# EAGLE design MCU (EAGLE 7.1.0)
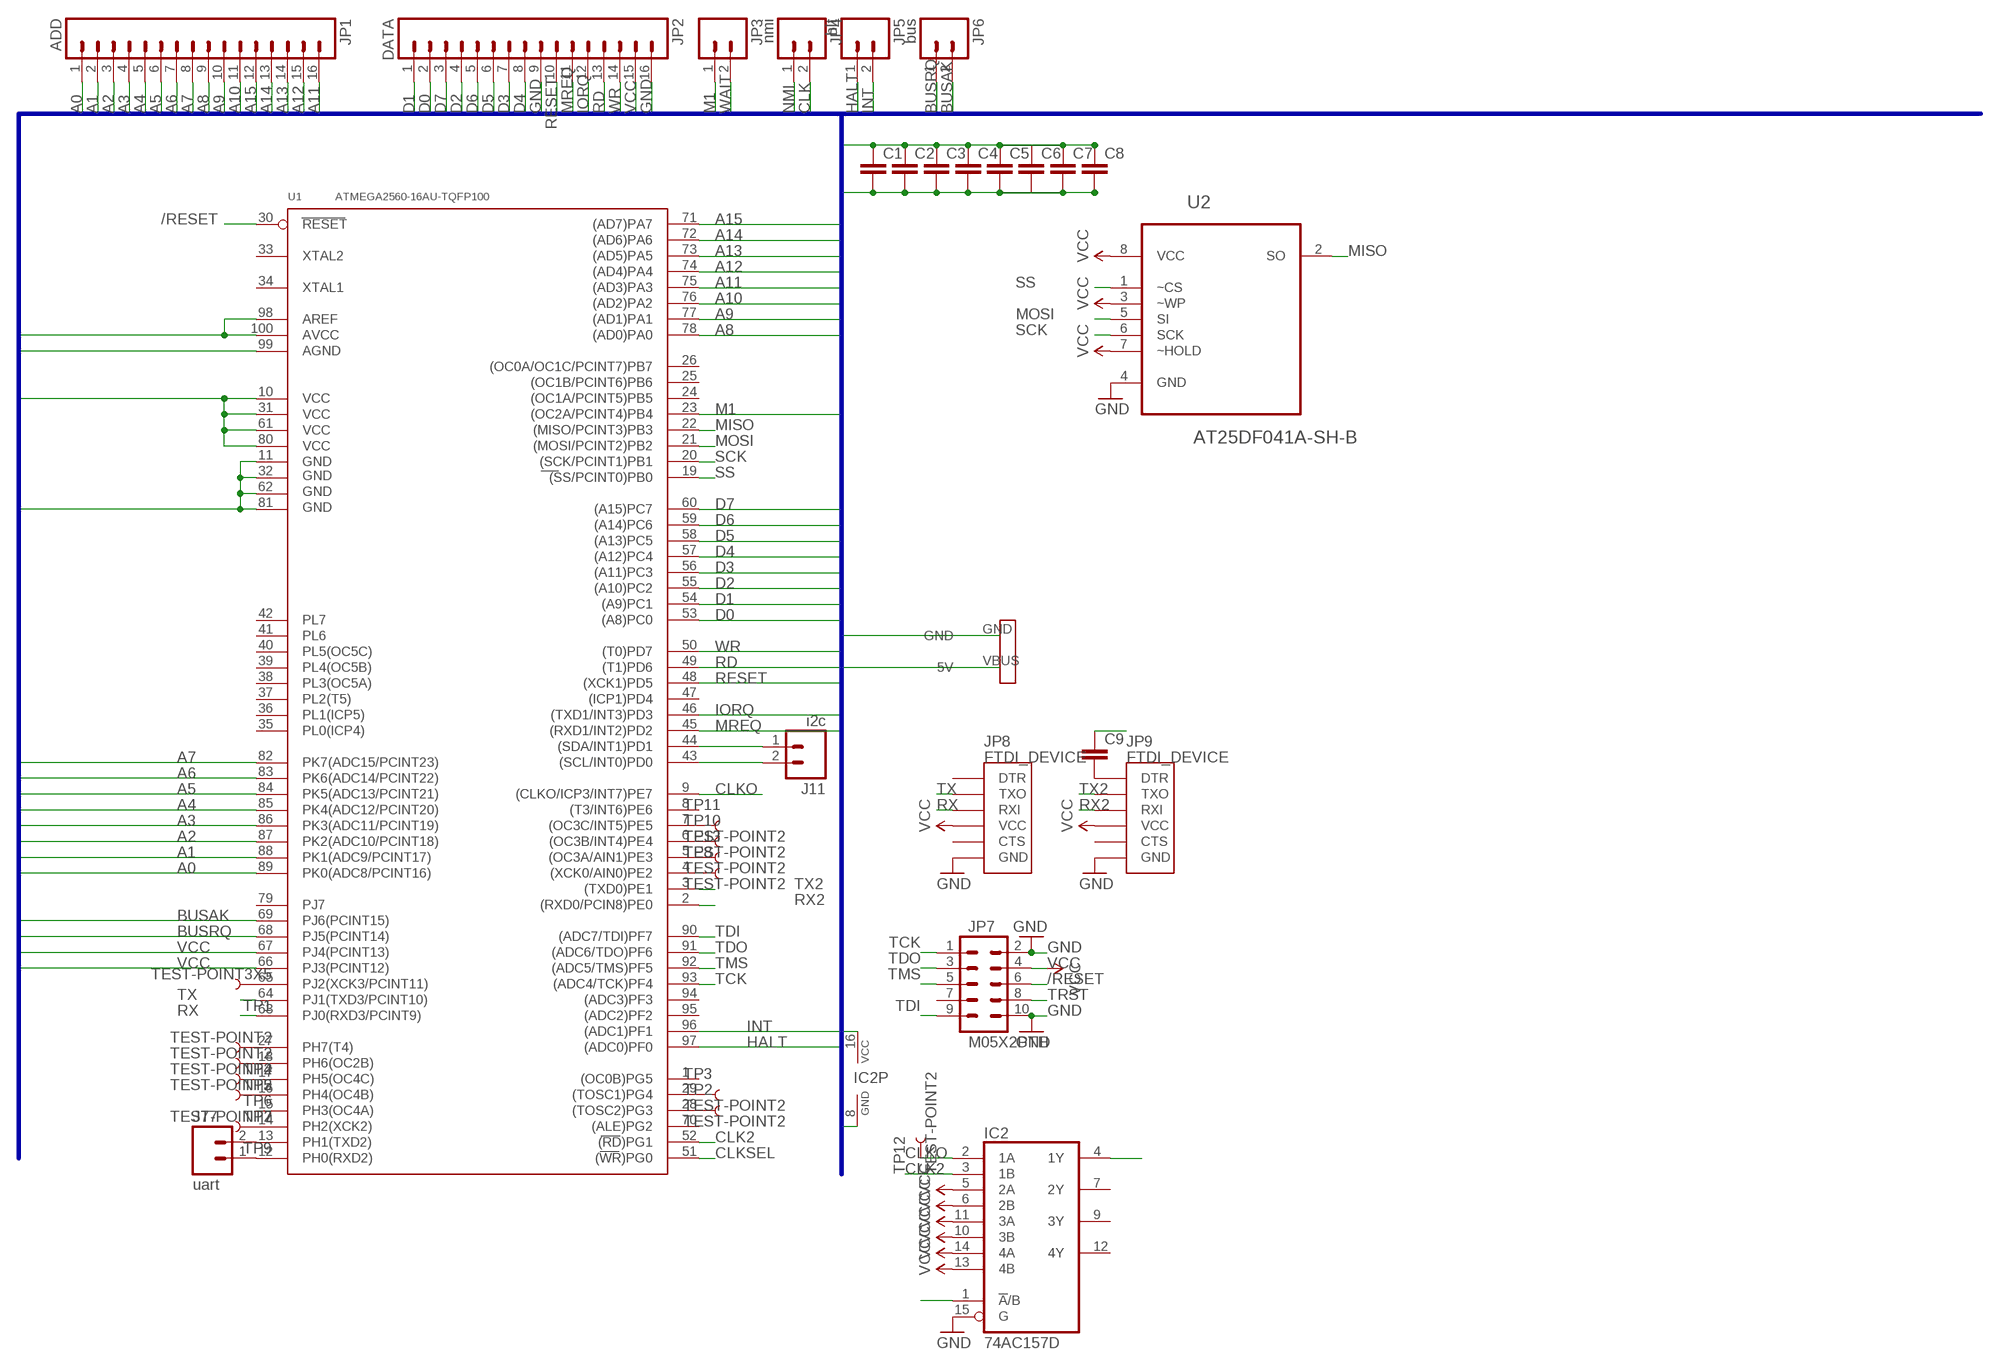
[diagram p0: schematic, sheet 1]

## Parts
C1  C-EUC0805  [C0805]
C2  C-EUC0805  [C0805]
C3  C-EUC0805  [C0805]
C4  C-EUC0805  [C0805]
C5  C-EUC0805  [C0805]
C6  C-EUC0805  [C0805]
C7  C-EUC0805  [C0805]
C8  C-EUC0805  [C0805]
C9  C-EUC0805  [C0805]
IC2  74AC157D  [SO16]
J11  i2c  M02PTH  [1X02]
J77  uart  M02PTH  [1X02]
JP1  ADD  M16PTH  [1X16]
JP2  DATA  M16PTH  [1X16]
JP3  M02PTH  [1X02]
JP4  nmi  M02PTH  [1X02]
JP5  hlt  M02PTH  [1X02]
JP6  bus  M02PTH  [1X02]
JP7  M05X2PTH  [AVR_ICSP]
JP8  FTDI_DEVICE  [FTDI_DEVICE_SIDE]
JP9  FTDI_DEVICE  [FTDI_DEVICE_SIDE]
TP1  TEST-POINT3X5  [PAD.03X.05]
TP2  TEST-POINT2  [PAD.02X.02]
TP3  TEST-POINT2  [PAD.02X.02]
TP4  TEST-POINT2  [PAD.02X.02]
TP5  TEST-POINT2  [PAD.02X.02]
TP6  TEST-POINT2  [PAD.02X.02]
TP7  TEST-POINT2  [PAD.02X.02]
TP8  TEST-POINT2  [PAD.02X.02]
TP9  TEST-POINT2  [PAD.02X.02]
TP10  TEST-POINT2  [PAD.02X.02]
TP11  TEST-POINT2  [PAD.02X.02]
TP12  TEST-POINT2  [PAD.02X.02]
TP13  TEST-POINT2  [PAD.02X.02]
U1  ATMEGA2560-16AU-TQFP100  MCU-ATMEGA2560-16AU(TQFP100)  [TQFP100-0.5-14X14MM]
U2  AT25DF041A-SH-B  [SOIC127P798X216-8N]
U$1  USB-MICRO-PWR  [USB-MICROB-PWR]

## Nets
/RESET: C9.1 JP7.6 U1.30(RESET)
A0: JP1.1 U1.89(PK0(ADC8/PCINT16))
A1: JP1.2 U1.88(PK1(ADC9/PCINT17))
A2: JP1.3 U1.87(PK2(ADC10/PCINT18))
A3: JP1.4 U1.86(PK3(ADC11/PCINT19))
A4: JP1.5 U1.85(PK4(ADC12/PCINT20))
A5: JP1.6 U1.84(PK5(ADC13/PCINT21))
A6: JP1.7 U1.83(PK6(ADC14/PCINT22))
A7: JP1.8 U1.82(PK7(ADC15/PCINT23))
A8: JP1.9 U1.78((AD0)PA0)
A9: JP1.10 U1.77((AD1)PA1)
A10: JP1.11 U1.76((AD2)PA2)
A11: JP1.16 U1.75((AD3)PA3)
A12: JP1.15 U1.74((AD4)PA4)
A13: JP1.14 U1.73((AD5)PA5)
A14: JP1.13 U1.72((AD6)PA6)
A15: JP1.12 U1.71((AD7)PA7)
BUSAK: JP6.2 U1.69(PJ6(PCINT15))
BUSRQ: JP6.1 U1.68(PJ5(PCINT14))
CLK: IC2.4(1Y) JP4.2
CLK2: IC2.3(1B) U1.52((RD)PG1)
CLKO: IC2.2(1A) TP12.P$1 U1.9((CLKO/ICP3/INT7)PE7)
CLKSEL: IC2.1(!A!/B) U1.51((WR)PG0)
D0: JP2.2 U1.53((A8)PC0)
D1: JP2.1 U1.54((A9)PC1)
D2: JP2.4 U1.55((A10)PC2)
D3: JP2.7 U1.56((A11)PC3)
D4: JP2.8 U1.57((A12)PC4)
D5: JP2.6 U1.58((A13)PC5)
D6: JP2.5 U1.59((A14)PC6)
D7: JP2.3 U1.60((A15)PC7)
GND: C1.2 C2.2 C3.2 C4.2 C5.2 C6.2 C7.2 C8.2 IC2.8(GND) IC2.15(G) JP2.9 JP2.16 JP7.2 JP7.10 JP8.P$6(GND) JP9.P$6(GND) U1.11(GND) U1.32(GND1) U1.62(GND2) U1.81(GND3) U1.99(AGND) U2.4(GND) U$1.GND
HALT: JP5.1 U1.97((ADC0)PF0)
INT: JP5.2 U1.96((ADC1)PF1)
IORQ: JP2.12 U1.46((TXD1/INT3)PD3)
M1: JP3.1 U1.23((OC2A/PCINT4)PB4)
MISO: U1.22((MISO/PCINT3)PB3) U2.2(SO)
MOSI: U1.21((MOSI/PCINT2)PB2) U2.5(SI)
MREQ: JP2.11 U1.45((RXD1/INT2)PD2)
N$1: J77.1 U1.12(PH0(RXD2))
N$2: J77.2 U1.13(PH1(TXD2))
N$3: J11.1 U1.44((SDA/INT1)PD1)
N$4: J11.2 U1.43((SCL/INT0)PD0)
N$5: TP1.P$1 U1.65(PJ2(XCK3/PCINT11))
N$6: TP2.P$1 U1.28((TOSC2)PG3)
N$7: TP3.P$1 U1.29((TOSC1)PG4)
N$8: TP4.P$1 U1.27(PH7(T4))
N$9: TP5.P$1 U1.18(PH6(OC2B))
N$10: TP6.P$1 U1.17(PH5(OC4C))
N$11: TP7.P$1 U1.16(PH4(OC4B))
N$12: TP8.P$1 U1.4((XCK0/AIN0)PE2)
N$13: TP9.P$1 U1.14(PH2(XCK2))
N$14: TP10.P$1 U1.6((OC3B/INT4)PE4)
N$15: TP11.P$1 U1.7((OC3C/INT5)PE5)
N$16: C9.2 JP9.P$1(DTR)
N$17: TP13.P$1 U1.5((OC3A/AIN1)PE3)
NMI: JP4.1
RD: JP2.13 U1.49((T1)PD6)
RESET: JP2.10 U1.48((XCK1)PD5)
RX: JP8.P$3(RXI) U1.63(PJ0(RXD3/PCINT9))
RX2: JP9.P$3(RXI) U1.2((RXD0/PCIN8)PE0)
SCK: U1.20((SCK/PCINT1)PB1) U2.6(SCK)
SS: U1.19((SS/PCINT0)PB0) U2.1(~CS)
TCK: JP7.1 U1.93((ADC4/TCK)PF4)
TDI: JP7.9 U1.90((ADC7/TDI)PF7)
TDO: JP7.3 U1.91((ADC6/TDO)PF6)
TMS: JP7.5 U1.92((ADC5/TMS)PF5)
TRST: JP7.8
TX: JP8.P$2(TXO) U1.64(PJ1(TXD3/PCINT10))
TX2: JP9.P$2(TXO) U1.3((TXD0)PE1)
VCC: C1.1 C2.1 C3.1 C4.1 C5.1 C6.1 C7.1 C8.1 IC2.5(2A) IC2.6(2B) IC2.10(3B) IC2.11(3A) IC2.13(4B) IC2.14(4A) IC2.16(VCC) JP2.15 JP7.4 JP8.P$4(VCC) JP9.P$4(VCC) U1.10(VCC) U1.31(VCC1) U1.61(VCC2) U1.66(PJ3(PCINT12)) U1.67(PJ4(PCINT13)) U1.80(VCC3) U1.98(AREF) U1.100(AVCC) U2.3(~WP) U2.7(~HOLD) U2.8(VCC) U$1.VBUS(5V)
WAIT: JP3.2
WR: JP2.14 U1.50((T0)PD7)
Unconnected: IC2.7(2Y) IC2.9(3Y) IC2.12(4Y) JP7.7 JP8.P$1(DTR) JP8.P$5(CTS) JP9.P$5(CTS) U1.1((OC0B)PG5) U1.8((T3/INT6)PE6) U1.15(PH3(OC4A)) U1.24((OC1A/PCINT5)PB5) U1.25((OC1B/PCINT6)PB6) U1.26((OC0A/OC1C/PCINT7)PB7) U1.33(XTAL2) U1.34(XTAL1) U1.35(PL0(ICP4)) U1.36(PL1(ICP5)) U1.37(PL2(T5)) U1.38(PL3(OC5A)) U1.39(PL4(OC5B)) U1.40(PL5(OC5C)) U1.41(PL6) U1.42(PL7) U1.47((ICP1)PD4) U1.70((ALE)PG2) U1.79(PJ7) U1.94((ADC3)PF3) U1.95((ADC2)PF2)

## Buses
A0,A1,A2,A3,A4,A5,A6,A7,A8,A9,A10,A11,A12,A13,A14,A15,D0,D1,D2,D3,D4,D5,D6,D7,GND,VCC,WR,RD,IORQ,MREQ,RESET,M1,CLK,WAIT,NMI,HALT,INT,BUSRQ,BUSAK

## Library data of the parts
C1-C9 = rcl:C-EU: CAPACITOR, European symbol
IC2 = 74xx-eu:74*157: Quadruple 2-line to 1-line data SELECTOR/MULTIPLEXER
J11 J77 JP3-JP6 = SparkFun:M02: Header 2 Standard 2-pin 0.1" header. Use with straight break away headers (SKU : PRT-00116), right angle break away headers (PRT-00553), swiss pins (PRT-00743), machine pins (PRT-00117), and female headers (PRT-00115). Molex polarized connector foot print use with SKU : PRT-08233 with associated crimp pins and housings.
JP1 JP2 = SparkFun-Connectors:M16: 1x16 .1" header
JP7 = SparkFun:M05X2: Header 5x2 Standard 10-pin dual row 0.1" header. Commonly used with AVR-ISP. Use with Spark Fun Electronics SKU: PRT-00778
JP8 JP9 = SparkFun-Connectors:FTDI_DEVICE: Connector which mates to FTDI basic or FTDI cable.
TP1-TP13 = SparkFun:TEST-POINT
U1 = Seeed-OPL-ic:MCU-ATMEGA2560-16AU(TQFP100): 310010006; MPN: ATMEGA2560-16AU
U2 = Atmel_By_element14_Batch_1:AT25DF041A-SH-B: 4-megabit Minimum SPI Serial Flash Memory; MPN: AT25DF041A-SH-B; OC_FARNELL: 1715440; OC_NEWARK: 15R0305; PACKAGE: SOIC-8; SUPPLIER: Atmel
U$1 = RalimTek:USB-MICRO-PWR

## Board
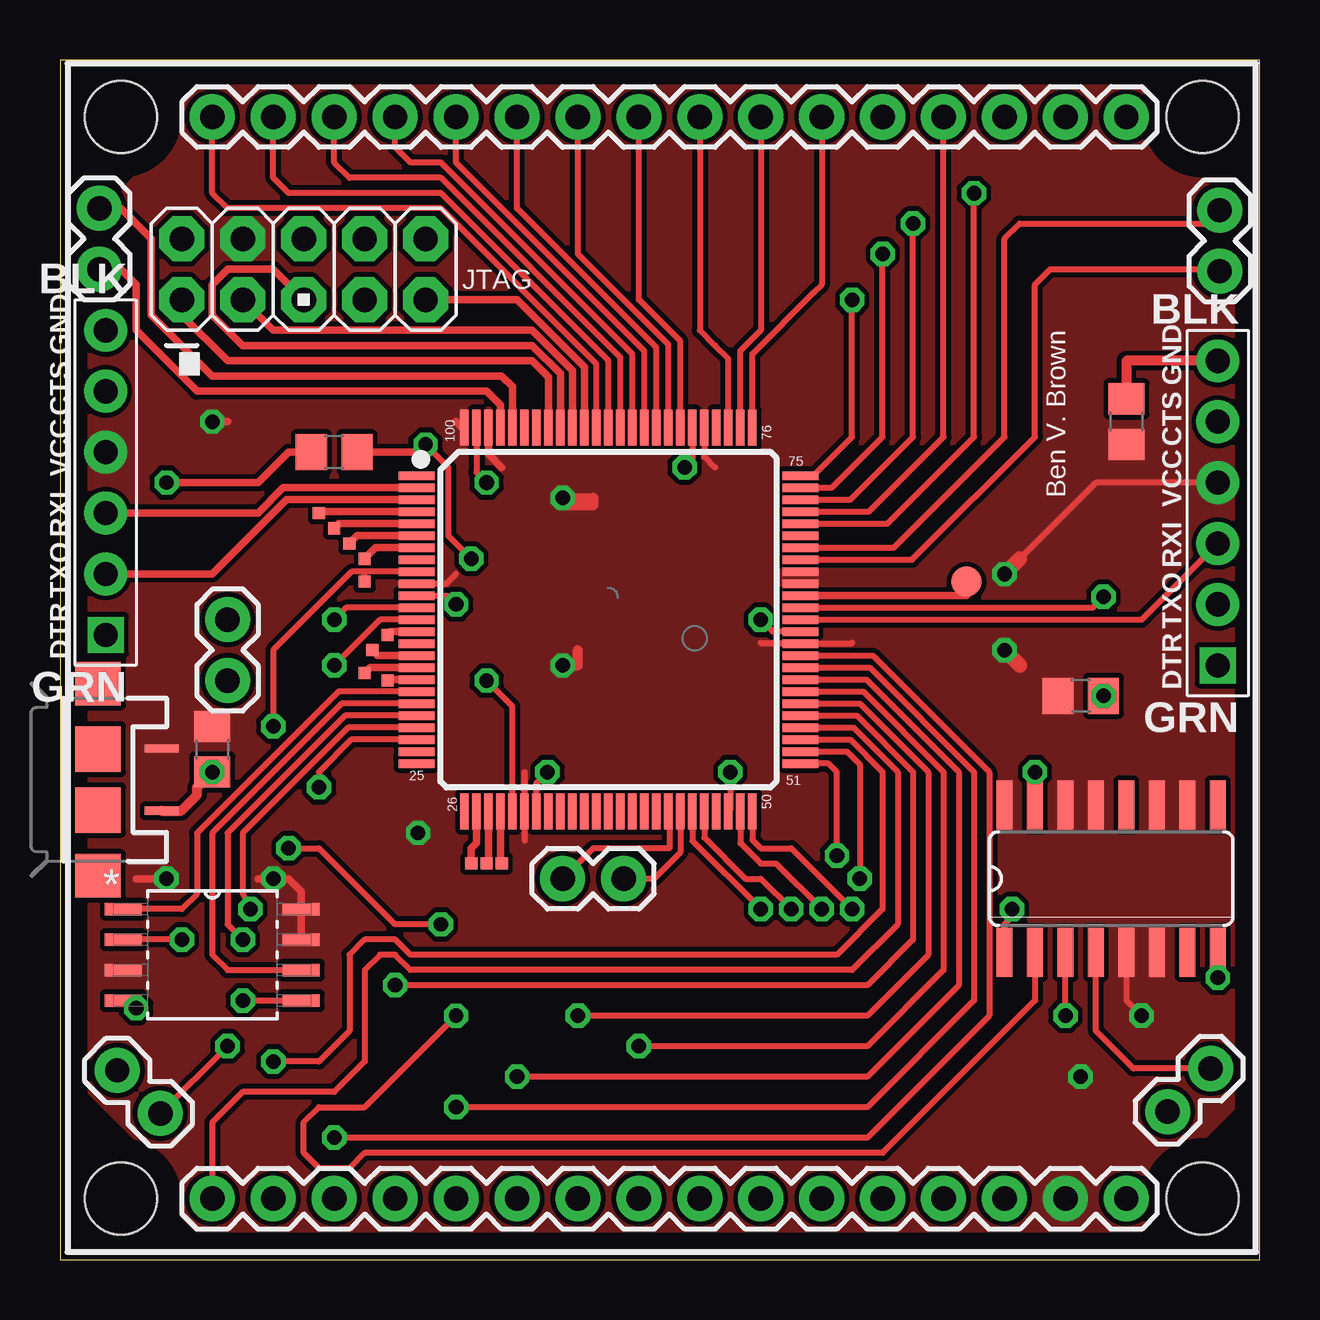
[diagram p1: board, top side]
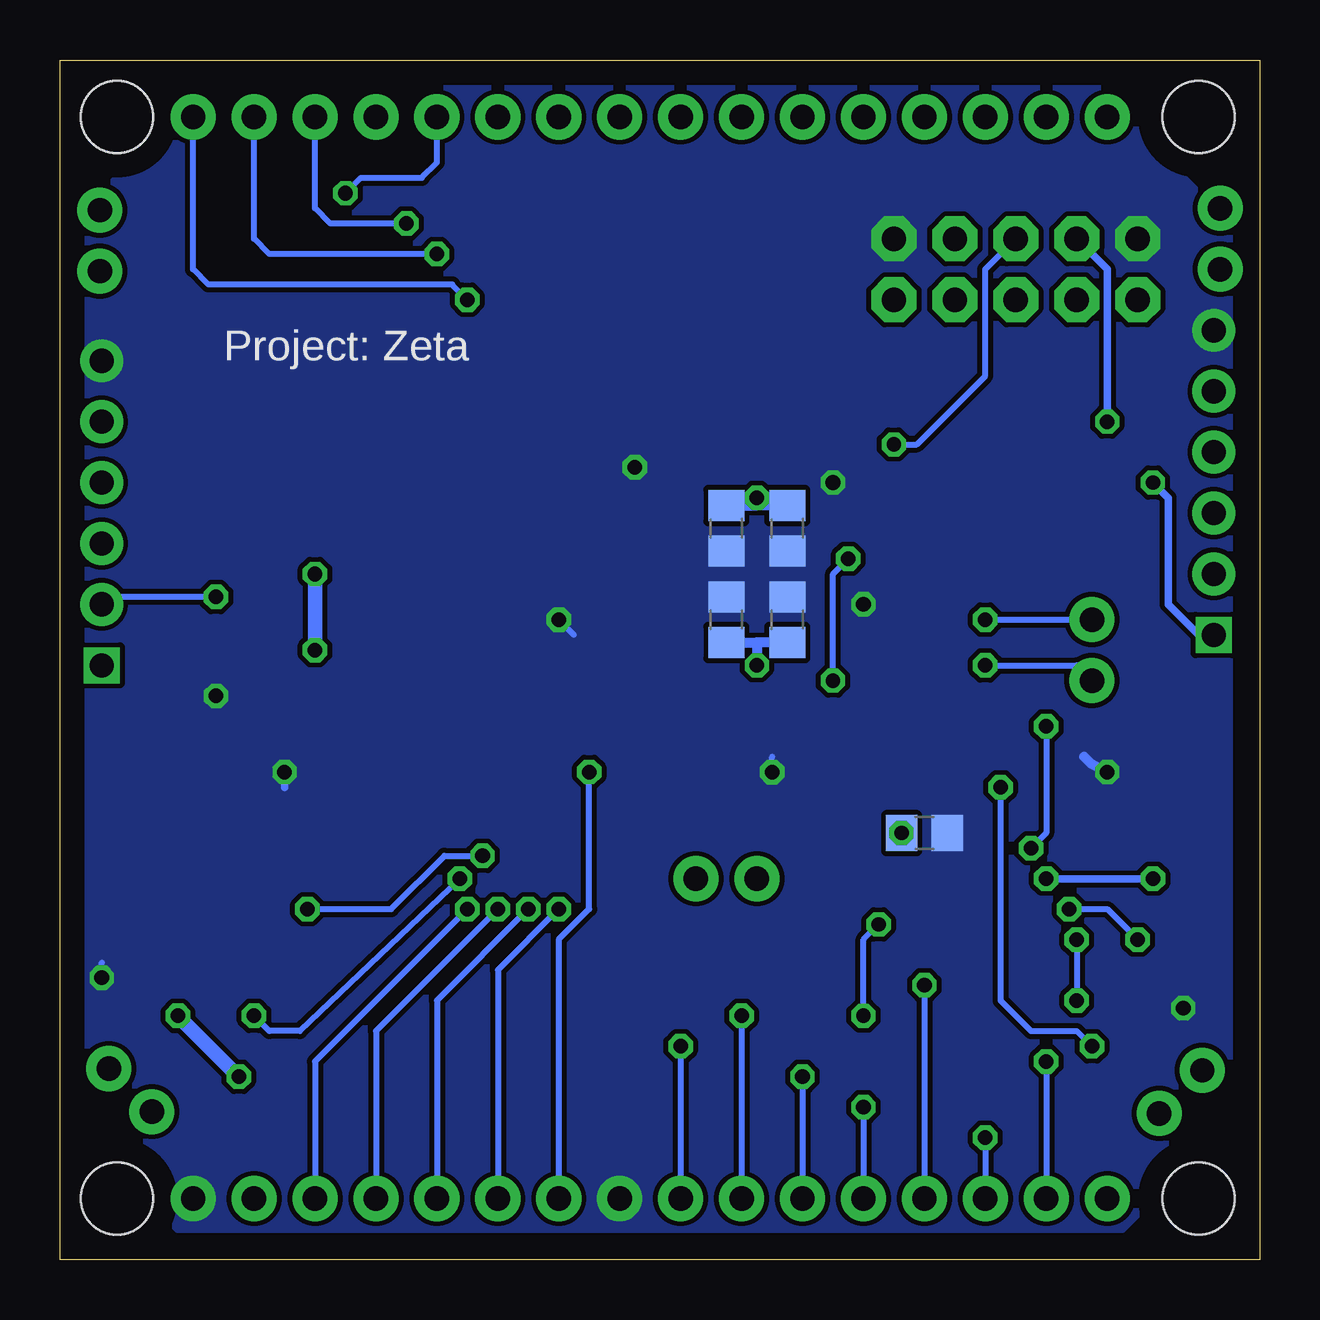
[diagram p2: board, bottom side, seen from below]

Size 50 x 50 mm. Coordinates in mm from the lower left corner, seen from the top.
Outline: 0,0 50,0 50,50 0,50 0,0
Copper layers (1*16): Top 0.035mm / dielectric 1.5mm / Bottom 0.035mm
Design rules "default": minimum track width 10mil, minimum drill 24mil, track to track 8mil, track to pad 8mil, pad to pad 8mil, via to via 8mil, smd to smd 8mil, copper to edge 40mil, drill to drill 8mil, minimum pad ring 10mil, minimum via ring 8mil, stop-mask expansion 4mil, vias tented up to drill 0mil, thermal gap 10mil
Holes 3 mm at 2.54,47.62 47.62,47.62 47.62,2.54 2.54,2.54

### Footprints (pad centres in the part's own frame; a part is rotated, then mirrored left to right if it is on the bottom)
C0805 = smd 1.3 x 1.5: 1 -0.95,0; 2 0.95,0
SO16 = smd 0.66 x 2.032: 1 -4.445,-3.073; 2 -3.175,-3.073; 3 -1.905,-3.073; 4 -0.635,-3.073; 5 0.635,-3.073; 6 1.905,-3.073; 7 3.175,-3.073; 8 4.445,-3.073; 9 4.445,3.073; 10 3.175,3.073; 11 1.905,3.073; 12 0.635,3.073; 13 -0.635,3.073; 14 -1.905,3.073; 15 -3.175,3.073; 16 -4.445,3.073
1X02 = drill 1.016 pad 1.88: 1 0,0; 2 2.54,0
1X16 = drill 1.016 pad 1.88: 1 0,0; 2 2.54,0; 3 5.08,0; 4 7.62,0; 5 10.16,0; 6 12.7,0; 7 15.24,0; 8 17.78,0; 9 20.32,0; 10 22.86,0; 11 25.4,0; 12 27.94,0; 13 30.48,0; 14 33.02,0; 15 35.56,0; 16 38.1,0
AVR_ICSP = drill 1.016 pad 1.88 octagon: 1 -1.27,5.08; 2 1.27,5.08; 3 -1.27,2.54; 4 1.27,2.54; 5 -1.27,0; 6 1.27,0; 7 -1.27,-2.54; 8 1.27,-2.54; 9 -1.27,-5.08; 10 1.27,-5.08
FTDI_DEVICE_SIDE = drill 1 square: P$1 -6.35,0 | drill 1.016 pad 1.778: P$2 -3.81,0; P$3 -1.27,0; P$4 1.27,0; P$5 3.81,0; P$6 6.35,0
PAD.03X.05 = smd 1.27 x 1.27: P$1 0,0
PAD.02X.02 = smd 0.508 x 0.508: P$1 0,0
TQFP100-0.5-14X14MM = smd 1.5 x 0.35: 1 -8,6; 2 -8,5.5; 3 -8,5; 4 -8,4.5; 5 -8,4; 6 -8,3.5; 7 -8,3; 8 -8,2.5; 9 -8,2; 10 -8,1.5; 11 -8,1; 12 -8,0.5; 13 -8,0; 14 -8,-0.5; 15 -8,-1; 16 -8,-1.5; 17 -8,-2; 18 -8,-2.5; 19 -8,-3; 20 -8,-3.5; 21 -8,-4; 22 -8,-4.5; 23 -8,-5; 24 -8,-5.5; 25 -8,-6; 51 8,-6; 52 8,-5.5; 53 8,-5; 54 8,-4.5; 55 8,-4; 56 8,-3.5; 57 8,-3; 58 8,-2.5; 59 8,-2; 60 8,-1.5; 61 8,-1; 62 8,-0.5; 63 8,0; 64 8,0.5; 65 8,1; 66 8,1.5; 67 8,2; 68 8,2.5; 69 8,3; 70 8,3.5; 71 8,4; 72 8,4.5; 73 8,5; 74 8,5.5; 75 8,6 | smd 0.35 x 1.5: 26 -6,-8; 27 -5.5,-8; 28 -5,-8; 29 -4.5,-8; 30 -4,-8; 31 -3.5,-8; 32 -3,-8; 33 -2.5,-8; 34 -2,-8; 35 -1.5,-8; 36 -1,-8; 37 -0.5,-8; 38 0,-8; 39 0.5,-8; 40 1,-8; 41 1.5,-8; 42 2,-8; 43 2.5,-8; 44 3,-8; 45 3.5,-8; 46 4,-8; 47 4.5,-8; 48 5,-8; 49 5.5,-8; 50 6,-8; 76 6,8; 77 5.5,8; 78 5,8; 79 4.5,8; 80 4,8; 81 3.5,8; 82 3,8; 83 2.5,8; 84 2,8; 85 1.5,8; 86 1,8; 87 0.5,8; 88 0,8; 89 -0.5,8; 90 -1,8; 91 -1.5,8; 92 -2,8; 93 -2.5,8; 94 -3,8; 95 -3.5,8; 96 -4,8; 97 -4.5,8; 98 -5,8; 99 -5.5,8; 100 -6,8
SOIC127P798X216-8N = smd 1.549 x 0.533: 1 -3.708,1.905; 2 -3.708,0.635; 3 -3.708,-0.635; 4 -3.708,-1.905; 5 3.708,-1.905; 6 3.708,-0.635; 7 3.708,0.635; 8 3.708,1.905
USB-MICROB-PWR = smd 0.35 x 1.4: GND 1.3,2.65; VBUS -1.3,2.65 | smd 1.8 x 1.9: MT1 -4,0; MT2 4,0 | smd 1.9 x 1.9: P$1 -1.27,0; P$2 1.27,0

### Placement (x,y rotation side)
C1  44.45,34.92 90 top
C2  6.35,21.27 270 top
C3  22.23,30.48 270 bottom
C4  19.68,30.48 270 bottom
C5  19.68,26.67 90 bottom
C6  22.23,26.67 90 bottom
C7  13.97,17.78 0 bottom
C8  42.55,23.5 0 top
C9  11.43,33.66 180 top
IC2  43.81,15.88 0 top
J11  23.5,15.88 180 top
J77  6.99,26.67 270 top
JP1  6.35,47.62 0 top
JP2  6.35,2.54 0 top
JP3  4.18,6.09 135 top
JP4  46.17,6.16 45 top
JP5  1.64,41.27 90 top
JP6  48.34,41.2 90 top
JP7  10.16,41.27 90 top
JP8  48.26,31.11 90 top
JP9  1.91,32.38 90 top
TP1  37.78,28.26 0 top
TP2  17.78,16.51 0 top
TP3  18.41,16.51 0 top
TP4  17.14,16.51 0 top
TP5  13.65,24.13 0 top
TP6  12.7,24.45 0 top
TP7  13.02,25.4 0 top
TP8  10.79,31.11 0 top
TP9  13.65,26.04 0 top
TP10  12.06,29.84 0 top
TP11  12.7,29.21 0 top
TP12  12.7,28.26 0 top
TP13  11.43,30.48 0 top
U1  22.86,26.67 0 top
U2  6.35,12.7 0 top
U$1  1.59,20 270 top

### Tracks (layer width: path | path; a pad name or v marks a point on that pad's centre or on a via)
/RESET  (via drill 0.6)
  Top 0.254: U1.30 18.86,23.05 v17.78,24.13 | v17.14,29.21 16.19,30.16 16.19,33.02 v15.24,33.97
  Top 0.305: C9.1 14.92,33.66 v15.24,33.97
  Bottom 0.254: v17.78,24.13 17.78,28.57 v17.14,29.21 | JP7.6 11.43,41.27 11.43,36.83 14.29,33.97 v15.24,33.97
A0
  Top 0.254: U1.89 22.36,37.33 15.88,43.81 6.99,43.81 6.35,44.45 JP1.1
A1
  Top 0.254: U1.88 22.86,37.47 15.88,44.45 9.53,44.45 8.89,45.09 JP1.2
A2
  Top 0.254: U1.87 23.36,37.6 15.88,45.09 12.06,45.09 11.43,45.72 JP1.3
A3
  Top 0.254: U1.86 23.86,37.73 15.88,45.72 14.61,45.72 13.97,46.35 JP1.4
A4
  Top 0.254: U1.85 24.36,37.87 16.51,45.72 JP1.5
A5
  Top 0.254: U1.84 24.86,38.01 19.05,43.81 JP1.6
A6
  Top 0.254: U1.83 25.36,38.14 21.59,41.91 JP1.7
A7
  Top 0.254: U1.82 25.86,38.27 24.13,40.01 JP1.8
A8
  Top 0.254: U1.78 27.86,37.55 27.3,38.1 26.67,38.73 JP1.9
A9
  Top 0.254: U1.77 28.36,37.88 29.21,38.73 JP1.10
A10
  Top 0.254: U1.76 28.86,37.75 31.43,40.32 31.75,40.64 JP1.11
A11  (via drill 0.61)
  Top 0.254: U1.75 31.4,32.67 33.02,34.29 v33.02,40.01
  Bottom 0.254: v33.02,40.01 33.66,40.64 43.81,40.64 44.45,41.27 JP1.16
A12  (via drill 0.61)
  Top 0.254: U1.74 32.17,32.17 34.29,34.29 v34.29,41.91
  Bottom 0.254: v34.29,41.91 41.27,41.91 41.91,42.55 JP1.15
A13  (via drill 0.61)
  Top 0.254: U1.73 32.94,31.67 35.56,34.29 v35.56,43.18
  Bottom 0.254: v35.56,43.18 38.73,43.18 39.37,43.81 JP1.14
A14
  Top 0.254: U1.72 33.71,31.17 36.83,34.29 JP1.13
A15  (via drill 0.61)
  Top 0.254: U1.71 34.48,30.67 38.1,34.29 v38.1,44.45
  Bottom 0.254: v38.1,44.45 37.47,45.09 34.92,45.09 34.29,45.72 JP1.12
BUSAK
  Top 0.254: U1.69 34.75,29.67 39.37,34.29 39.37,42.55 40.01,43.18 47.78,43.18 JP6.2
BUSRQ
  Top 0.254: U1.68 35.52,29.17 40.64,34.29 40.64,40.64 41.27,41.27 48.26,41.27 JP6.1
CLK
  Top 0.254: JP4.2 44.74,7.96 43.18,9.53 IC2.4
CLK2  (via drill 0.61)
  Top 0.254: U1.52 32.8,21.17 33.34,20.64 v33.34,15.88 | v41.91,10.16 IC2.3
  Bottom 0.254: v41.91,10.16 41.27,9.53 40.01,9.53 v33.34,15.88
CLKO  (via drill 0.6, 0.61)
  Top 0.254: U1.9 12.7,28.67 | 12.7,28.67 12.16,28.67 8.89,25.4 v8.89,22.23 | v9.53,17.14 10.79,17.14 13.97,13.97 v15.88,13.97 | IC2.2 40.64,10.79 34.29,4.45 12.7,4.45 12.06,3.81 10.79,3.81 10.16,4.45 10.16,5.71 10.79,6.35 12.7,6.35 v16.51,10.16 | TP12.P$1 12.7,28.67
  Bottom 0.254: v8.89,22.23 8.89,17.78 v9.53,17.14 | v16.51,10.16 16.51,13.34 v15.88,13.97
CLKSEL  (via drill 0.61)
  Top 0.254: IC2.1 39.37,13.97 39.69,14.29 v39.69,14.61 | v32.38,16.83 32.38,20.32 32.03,20.67 U1.51
  Bottom 0.254: v39.69,14.61 36.2,14.61 33.97,16.83 v32.38,16.83
D0  (via drill 0.61)
  Top 0.254: U1.53 32.94,21.67 34.29,20.32 34.29,14.61 32.38,12.7 14.61,12.7 13.97,13.34 12.7,13.34 12.06,12.7 12.06,9.53 10.79,8.26 v8.89,8.26
  Bottom 0.254: v8.89,8.26 JP2.2
D1
  Top 0.254: U1.54 33.08,22.17 34.92,20.32 34.92,13.97 33.02,12.06 14.61,12.06 13.97,12.7 13.34,12.7 12.7,12.06 12.7,8.26 11.43,6.99 7.62,6.99 6.35,5.71 JP2.1
D2  (via drill 0.61)
  Top 0.254: U1.55 33.21,22.67 35.56,20.32 35.56,13.34 33.66,11.43 v13.97,11.43
  Bottom 0.254: v13.97,11.43 JP2.4
D3  (via drill 0.61)
  Top 0.254: U1.56 33.34,23.17 36.2,20.32 36.2,12.7 33.66,10.16 v21.59,10.16
  Bottom 0.254: v21.59,10.16 JP2.7
D4  (via drill 0.61)
  Top 0.254: U1.57 33.48,23.67 36.83,20.32 36.83,12.06 33.66,8.89 v24.13,8.89
  Bottom 0.254: v24.13,8.89 JP2.8
D5  (via drill 0.61)
  Top 0.254: U1.58 33.62,24.17 37.47,20.32 37.47,11.43 33.66,7.62 v19.05,7.62
  Bottom 0.254: v19.05,7.62 JP2.6
D6  (via drill 0.61)
  Top 0.254: U1.59 33.75,24.67 38.1,20.32 38.1,10.79 33.66,6.35 v16.51,6.35
  Bottom 0.254: v16.51,6.35 JP2.5
D7  (via drill 0.61)
  Top 0.254: U1.60 33.88,25.17 38.73,20.32 38.73,10.16 33.66,5.08 v11.43,5.08
  Bottom 0.254: v11.43,5.08 JP2.3
GND  (via drill 0.6, 0.61)
  Top 0.254: IC2.8 v48.26,11.75 | U2.4 3.17,10.79 v3.17,10.48 | U1.11 16.14,27.67 v16.51,27.3 | U1.99 17.36,32.8 v17.78,32.38 | U1.81 26.36,33.33 v26.04,33.02 | U1.62 29.71,26.17 v29.21,26.67 | U1.32 19.86,19.86 v20.32,20.32
  Top 0.305: C8.2 | IC2.15 v40.64,20.32
  Top 0.406: JP8.P$6 44.45,37.47 C1.2 | U$1.GND 5.05,18.7 5.71,19.37 5.71,19.69 C2.2 6.04,20 C2.2
  Bottom 0.254: v48.26,11.75 48.26,12.38 | v3.17,10.48 3.49,10.48 | v16.51,27.3 16.83,27.3 | v26.04,33.02 26.35,33.02 | v29.21,26.67 28.57,26.04 | v20.32,20.32 20.32,20.95
  Bottom 0.305: C8.2 43.81,23.5 | v40.64,20.32 40.64,19.68
  Bottom 0.406: C2.2 6.99,20.64 7.3,20.95
  other vias: 43.5,23.5 6.35,20.32
  pour Bottom (no thermals): 1.27,6.99 5.08,3.17 5.08,1.91 5.71,1.27 45.09,1.27 45.72,1.91 45.72,3.17 48.9,6.35 48.9,43.81 45.72,46.99 45.72,48.26 45.09,48.9 5.71,48.9 5.08,48.26 5.08,46.99 1.27,43.18
HALT
  Top 0.305: U1.97 18.36,35.62 17.78,36.2 5.71,36.2 3.17,38.73 3.17,40.64 2.54,41.27 JP5.1
INT
  Top 0.305: U1.96 18.86,36.38 18.41,36.83 6.35,36.83 3.81,39.37 3.81,42.55 2.54,43.81 JP5.2
IORQ  (via drill 0.61)
  Top 0.254: U1.46 26.86,17.59 28.57,15.88 29.21,15.88 v30.48,14.61
  Bottom 0.254: v30.48,14.61 34.29,10.79 JP2.12
M1  (via drill 0.61)
  Top 0.254: U1.23 12.14,21.67 10.79,20.32 v10.79,19.68 | v6.99,8.89 | v6.99,8.89 JP3.1
  Bottom 0.254: v10.79,19.68 10.79,10.79 9.53,9.53 7.62,9.53 v6.99,8.89
MISO  (via drill 0.61)
  Top 0.254: v7.94,14.61 7.62,15.24 7.62,17.78 12.01,22.17 U1.22 | v5.08,13.34 U2.2
  Bottom 0.254: v7.94,14.61 6.35,14.61 v5.08,13.34
MOSI  (via drill 0.61)
  Top 0.254: v7.62,13.34 6.99,13.97 6.99,17.78 11.88,22.67 U1.21 | v7.62,10.79 U2.5
  Bottom 0.254: v7.62,13.34 v7.62,10.79
MREQ  (via drill 0.61)
  Top 0.254: U1.45 26.36,17.45 v29.21,14.61
  Bottom 0.254: v29.21,14.61 31.75,12.06 JP2.11
N$1  (via drill 0.61)
  Top 0.254: U1.12 11.93,27.17 v11.43,26.67
  Bottom 0.254: v11.43,26.67 J77.1
N$2  (via drill 0.61)
  Top 0.254: U1.13 13.34,26.67 v11.43,24.77
  Bottom 0.254: v11.43,24.77 7.62,24.77 J77.2
N$3
  Top 0.254: U1.44 25.86,16.97 24.77,15.88 J11.1
N$4
  Top 0.254: U1.43 25.4,18.63 25.4,17.14 22.23,17.14 J11.2
N$5
  Top 0.305: U1.65 37.78,27.67 TP1.P$1
N$6
  Top 0.305: U1.28 17.86,16.59 TP2.P$1
N$7
  Top 0.305: U1.29 18.36,16.57 TP3.P$1
N$8
  Top 0.305: U1.27 17.36,17.36 17.14,17.14 TP4.P$1
N$9
  Top 0.305: U1.18 13.69,24.17 TP5.P$1
N$10
  Top 0.305: U1.17 12.92,24.67 TP6.P$1
N$11
  Top 0.305: U1.16 13.25,25.17 TP7.P$1
N$12
  Top 0.305: U1.4 10.85,31.17 TP8.P$1
N$13
  Top 0.305: U1.14 13.79,26.17 TP9.P$1
N$14
  Top 0.305: U1.6 12.39,30.17 TP10.P$1
N$15
  Top 0.305: U1.7 13.16,29.67 TP11.P$1
N$16  (via drill 0.6)
  Top 0.305: v4.45,32.38 8.26,32.38 9.53,33.66 C9.2
  Bottom 0.305: JP9.P$1 2.54,26.04 3.81,27.3 3.81,31.75 v4.45,32.38
N$17
  Top 0.305: U1.5 11.62,30.67 TP13.P$1
RD  (via drill 0.61)
  Top 0.254: U1.49 28.36,17.36 29.21,16.51 29.84,16.51 v31.75,14.61
  Bottom 0.254: v31.75,14.61 36.83,9.53 JP2.13
RESET  (via drill 0.6)
  Top 0.254: v27.94,20.32 27.94,18.75 U1.48
  Bottom 0.254: JP2.10 29.21,13.34 27.94,14.61 v27.94,20.32
RX
  Top 0.254: U1.63 45.09,26.67 JP8.P$3
RX2
  Top 0.305: U1.2 9.31,32.17 8.26,31.11 JP9.P$3
SCK
  Top 0.254: U2.6 6.99,12.06 6.35,12.7 6.35,17.78 11.74,23.17 U1.20
SS
  Top 0.254: U2.1 5.08,14.61 5.71,15.24 5.71,17.78 11.61,23.67 U1.19
TCK
  Top 0.305: U1.93 20.36,36.79 19.68,37.47 6.99,37.47 5.08,39.37 JP7.1
TDI
  Top 0.305: U1.90 21.86,37.2 19.05,40.01 JP7.9
TDO
  Top 0.305: U1.91 21.36,37.06 19.68,38.73 8.89,38.73 JP7.3
TMS
  Top 0.305: U1.92 20.86,36.92 19.68,38.1 7.62,38.1 6.35,39.37 6.35,40.64 6.99,41.27 8.89,41.27 JP7.5
TX  (via drill 0.61)
  Top 0.254: U1.64 43.05,27.17 v43.5,27.62
  Bottom 0.254: v43.5,27.62 47.94,27.62 JP8.P$2
TX2
  Top 0.305: U1.3 9.45,31.67 6.35,28.57 JP9.P$2
VCC  (via drill 0.6, 0.61)
  Top 0.254: IC2.5 44.45,10.79 v45.09,10.16 | U1.10 16.11,28.17 16.51,28.57 | 33.02,25.72 32.97,25.67 U1.61 29.26,25.67 29.21,25.72 | U1.80 26.86,33.47 27.3,33.02 | U1.31 19.36,20.31 19.37,20.32 19.37,17.46 | JP8.P$4 43.18,32.38 40.01,29.21
  Top 0.305: U2.7 10.06,15.34 9.53,15.88 v8.89,15.88 8.26,15.88 | v4.45,15.88 3.17,15.88 | U1.98 17.86,33.58 18.41,33.02 | U1.100 16.77,34.67 16.51,34.92 | v6.35,34.92 6.99,34.92
  Top 0.406: v20.95,24.77 21.59,24.77 21.59,25.4 | v20.95,31.75 22.23,31.75 C3.1 20.95,31.43 v20.95,31.75
  Top 0.61: 40.01,29.21 v39.37,28.57 | v39.37,25.4 40.01,24.77
  Bottom 0.305: v8.89,15.88 v4.45,15.88 | C7.1 | JP7.4 6.35,41.27 v6.35,34.92
  Bottom 0.406: C4.1 20.95,31.43 | C6.1 20.95,25.72 | C5.1 20.95,25.72 | 20.95,25.72 v20.95,24.77 | C3.1 20.95,31.43 | 20.95,31.43 v20.95,31.75
  Bottom 0.61: v45.09,10.16 v42.55,7.62 | v39.37,28.57 v39.37,25.4
  other vias: 14.92,17.78
  pour Top (no thermals): 1.27,6.99 5.08,3.17 5.08,1.91 5.71,1.27 45.09,1.27 45.72,1.91 45.72,3.17 48.9,6.35 48.9,43.81 45.72,46.99 45.72,48.26 45.09,48.9 5.71,48.9 5.08,48.26 5.08,46.99 1.27,43.18
WR  (via drill 0.61)
  Top 0.254: U1.50 28.86,17.5 29.21,17.14 30.48,17.14 v33.02,14.61
  Bottom 0.254: v33.02,14.61 39.37,8.26 JP2.14

### Text on the board
tPlace: JTAG | . | Ben V. Brown
bPlace: Project: Zeta